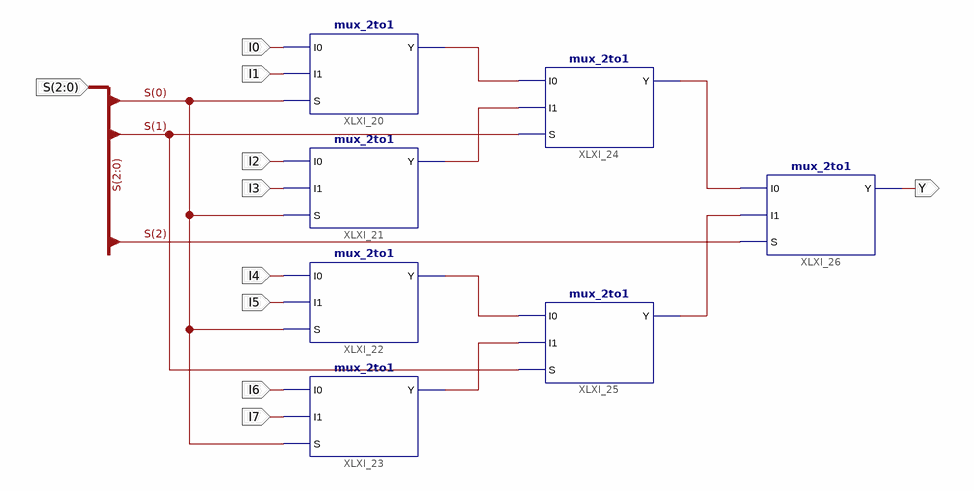
[diagram p0: schematic sheet 1]
// Xilinx ISE schematic mux_8to1.sch (virtex6) as structural Verilog: 7 symbols, 10 ports
module mux_8to1 (
  input  [2:0] S,
  input  I0,
  input  I1,
  input  I2,
  input  I3,
  input  I4,
  input  I5,
  input  I6,
  input  I7,
  output Y
);

  wire XLXN_1, XLXN_2, XLXN_3, XLXN_4, XLXN_5, XLXN_6;

  mux_2to1 XLXI_20 (.I0(I0), .I1(I1), .S(S[0]), .Y(XLXN_1));
  mux_2to1 XLXI_21 (.I0(I2), .I1(I3), .S(S[0]), .Y(XLXN_2));
  mux_2to1 XLXI_22 (.I0(I4), .I1(I5), .S(S[0]), .Y(XLXN_3));
  mux_2to1 XLXI_23 (.I0(I6), .I1(I7), .S(S[0]), .Y(XLXN_4));
  mux_2to1 XLXI_26 (.I0(XLXN_5), .I1(XLXN_6), .S(S[2]), .Y(Y));
  mux_2to1 XLXI_24 (.I0(XLXN_1), .I1(XLXN_2), .S(S[1]), .Y(XLXN_5));
  mux_2to1 XLXI_25 (.I0(XLXN_3), .I1(XLXN_4), .S(S[1]), .Y(XLXN_6));
endmodule
